# EAGLE schematic as3320-BandPass (EAGLE 9.6.2)

## Sheet 1 of 5: CEM
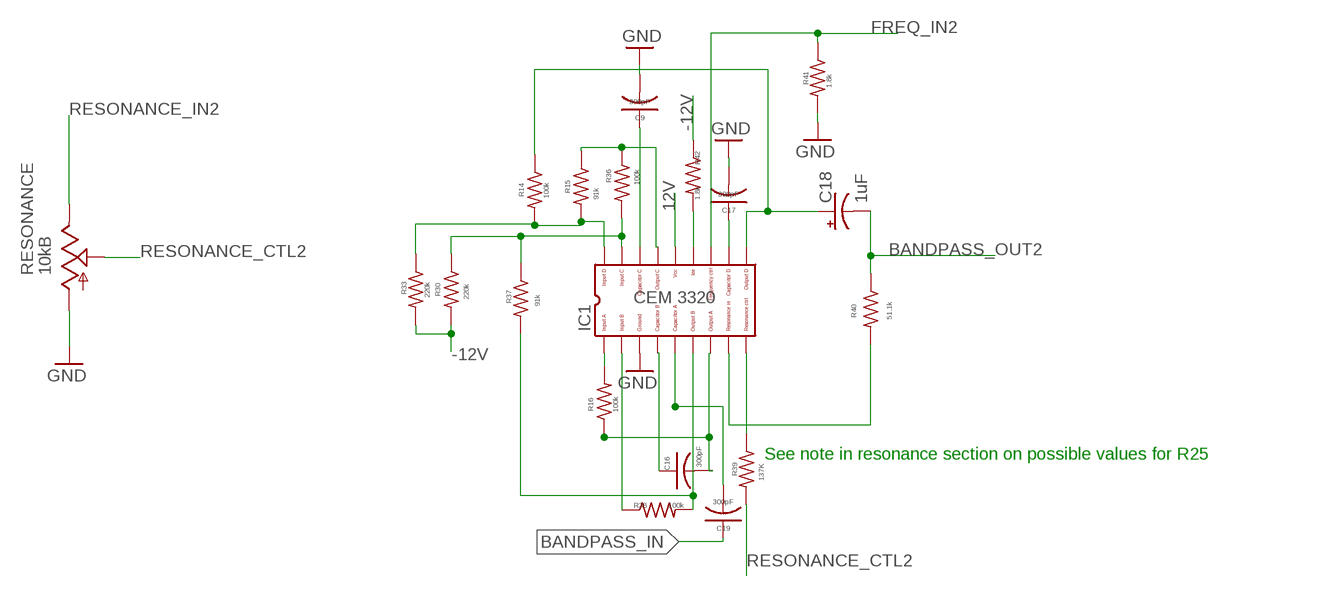
[diagram p0: schematic, sheet 1]

### Parts
C9  300pF  C-USC0805K  [C0805K]
C16  300pF  C-USC0805K  [C0805K]
C17  300pF  C-USC0805K  [C0805K]
C18  1uF  CPOL-USB  [PANASONIC_B]
C19  300pF  C-USC0805K  [C0805K]
IC1  CEM3320  [DIL18]
R14  100k  GMSN_R-US_M0805  [GMSN_M0805]
R15  91k  GMSN_R-US_M0805  [GMSN_M0805]
R16  100k  GMSN_R-US_M0805  [GMSN_M0805]
R30  220k  GMSN_R-US_M0805  [GMSN_M0805]
R33  220k  GMSN_R-US_M0805  [GMSN_M0805]
R36  100k  GMSN_R-US_M0805  [GMSN_M0805]
R37  91k  GMSN_R-US_M0805  [GMSN_M0805]
R38  100k  GMSN_R-US_M0805  [GMSN_M0805]
R39  137K  GMSN_R-US_M0805  [GMSN_M0805]
R40  51.1k  GMSN_R-US_M0805  [GMSN_M0805]
R41  1.8k  GMSN_R-US_M0805  [GMSN_M0805]
R42  1.8k  GMSN_R-US_M0805  [GMSN_M0805]
RESONANCE  10kB  POT_USVERTICAL  [ALPS_POT_VERTICAL]

### Nets
12V [power]: IC1.14 ; also sheet 2,3
-12V [power]: R30.2 R33.2 R42.1 ; also sheet 2,3
BANDPASS_IN: C19.1 ; also sheet 3
BANDPASS_OUT2: C18.- R40.1 ; also sheet 5
FREQ_IN2: IC1.12 R41.1 ; also sheet 3
GND [power]: C9.2 C17.2 IC1.3 R41.2 RESONANCE.P$3(A) ; also sheet 2,3,4,5
N$18 [nearfilter]: C17.1 IC1.11
N$21: IC1.9 R39.1
N$28 [nearfilter]: IC1.8 R40.2
N$29 [nearfilter]: IC1.13 R42.2
N$30: C9.1 IC1.16
N$31 [nearfilter]: C18.+ IC1.10 R14.1
N$32: C19.2 IC1.5
N$33: C16.2 IC1.7 R16.1
N$34: C16.1 IC1.4
N$35: IC1.2 R38.1
N$36: IC1.6 R37.2 R38.2
N$37: IC1.1 R16.2
N$38: IC1.17 R30.1 R36.2 R37.1
N$41: IC1.15 R15.1 R36.1
N$42: IC1.18 R14.2 R15.2 R33.1
RESONANCE_CTL2: R39.2 RESONANCE.P$2(S)
RESONANCE_IN2: RESONANCE.P$1(E) ; also sheet 3

### Notes on the sheet
- See note in resonance section on possible values for R25

## Sheet 2 of 5: Power
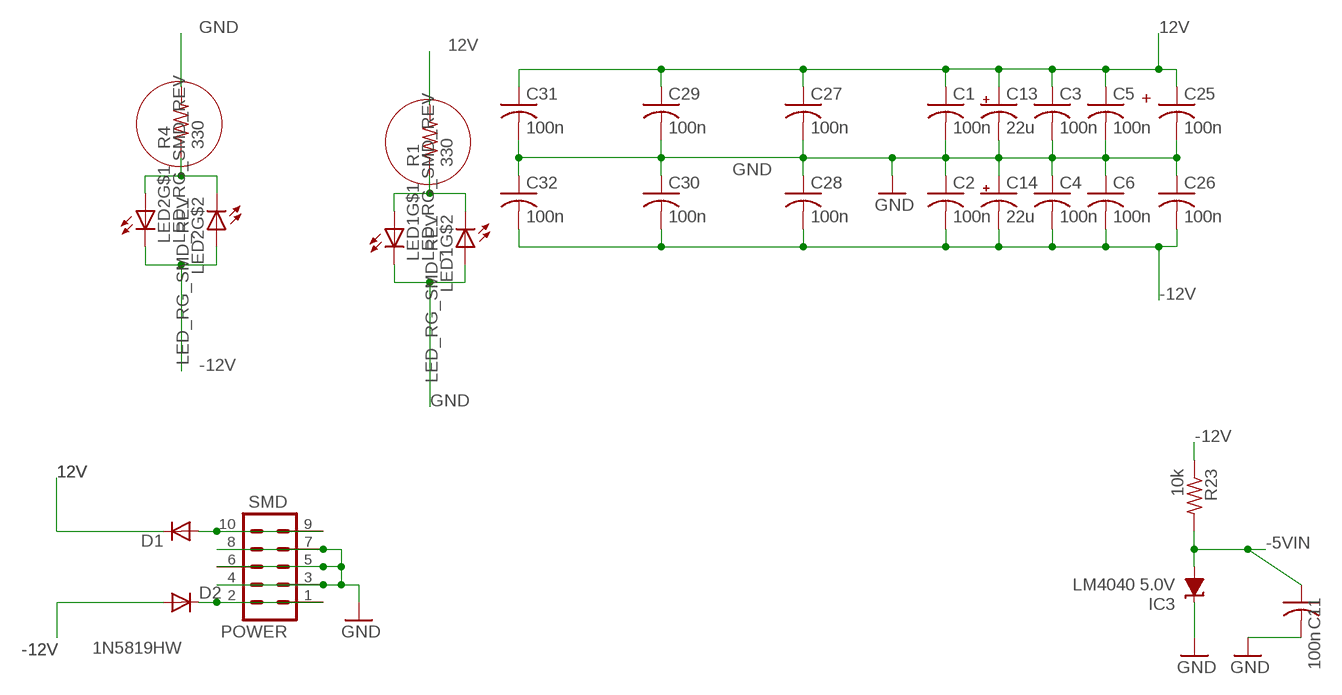
[diagram p1: schematic, sheet 2]

### Parts
C1  100n  C-USC0805K  [C0805K]
C2  100n  C-USC0805K  [C0805K]
C3  100n  C-USC0805K  [C0805K]
C4  100n  C-USC0805K  [C0805K]
C5  100n  C-USC0805K  [C0805K]
C6  100n  C-USC0805K  [C0805K]
C11  100n  GMSN_C-USC0805K  [GMSN_C0805K]
C13  22u  CPOL-USB  [PANASONIC_B]
C14  22u  CPOL-USB  [PANASONIC_B]
C25  100n  C-USC0805K  [C0805K]
C26  100n  C-USC0805K  [C0805K]
C27  100n  C-USC0805K  [C0805K]
C28  100n  C-USC0805K  [C0805K]
C29  100n  C-USC0805K  [C0805K]
C30  100n  C-USC0805K  [C0805K]
C31  100n  C-USC0805K  [C0805K]
C32  100n  C-USC0805K  [C0805K]
D1  1N5819HW  DIODE-SOD123  [SOD123]
D2  1N5819HW  DIODE-SOD123  [SOD123]
IC3  LM4040 5.0V  LM4041C12DBZ  [DBZ_R-PDSO-G3]
LED1  LED_RG_SMD_REV  [LSG_T77K]
LED2  LED_RG_SMD_REV  [LSG_T77K]
POWER  SMD  CONN_05X2SHD_SMD  [2X5-SHROUDED_SMD]
R1  330  GMSN_R-US_M0805  [GMSN_M0805]
R4  330  GMSN_R-US_M0805  [GMSN_M0805]
R23  10k  GMSN_R-US_M0805  [GMSN_M0805]

### Nets
12V [power]: C1.1 C3.1 C5.1 C13.+ C25.1 C27.1 C29.1 C31.1 D1.C R1.2 ; also sheet 1,3
-5VIN [power]: C11.1 IC3.2(A) R23.2 ; also sheet 4
-12V [power]: C2.2 C4.2 C6.2 C14.- C26.2 C28.2 C30.2 C32.2 D2.A LED2.1(C) LED2.4(A) R23.1 ; also sheet 1,3
-12V-P: D2.C POWER.1 POWER.2
GND [power]: C1.2 C2.1 C3.2 C4.1 C5.2 C6.1 C11.2 C13.- C14.+ C25.2 C26.1 C27.2 C28.1 C29.2 C30.1 C31.2 C32.1 IC3.1(C) LED1.1(C) LED1.4(A) POWER.3 POWER.4 POWER.5 POWER.6 POWER.7 POWER.8 R4.2 ; also sheet 1,3,4,5
N$6: D1.A POWER.9 POWER.10
N$74: LED2.2(A) LED2.3(C) R4.1
N$75: LED1.2(A) LED1.3(C) R1.1

### Notes on the sheet
- +

## Sheet 3 of 5: Input
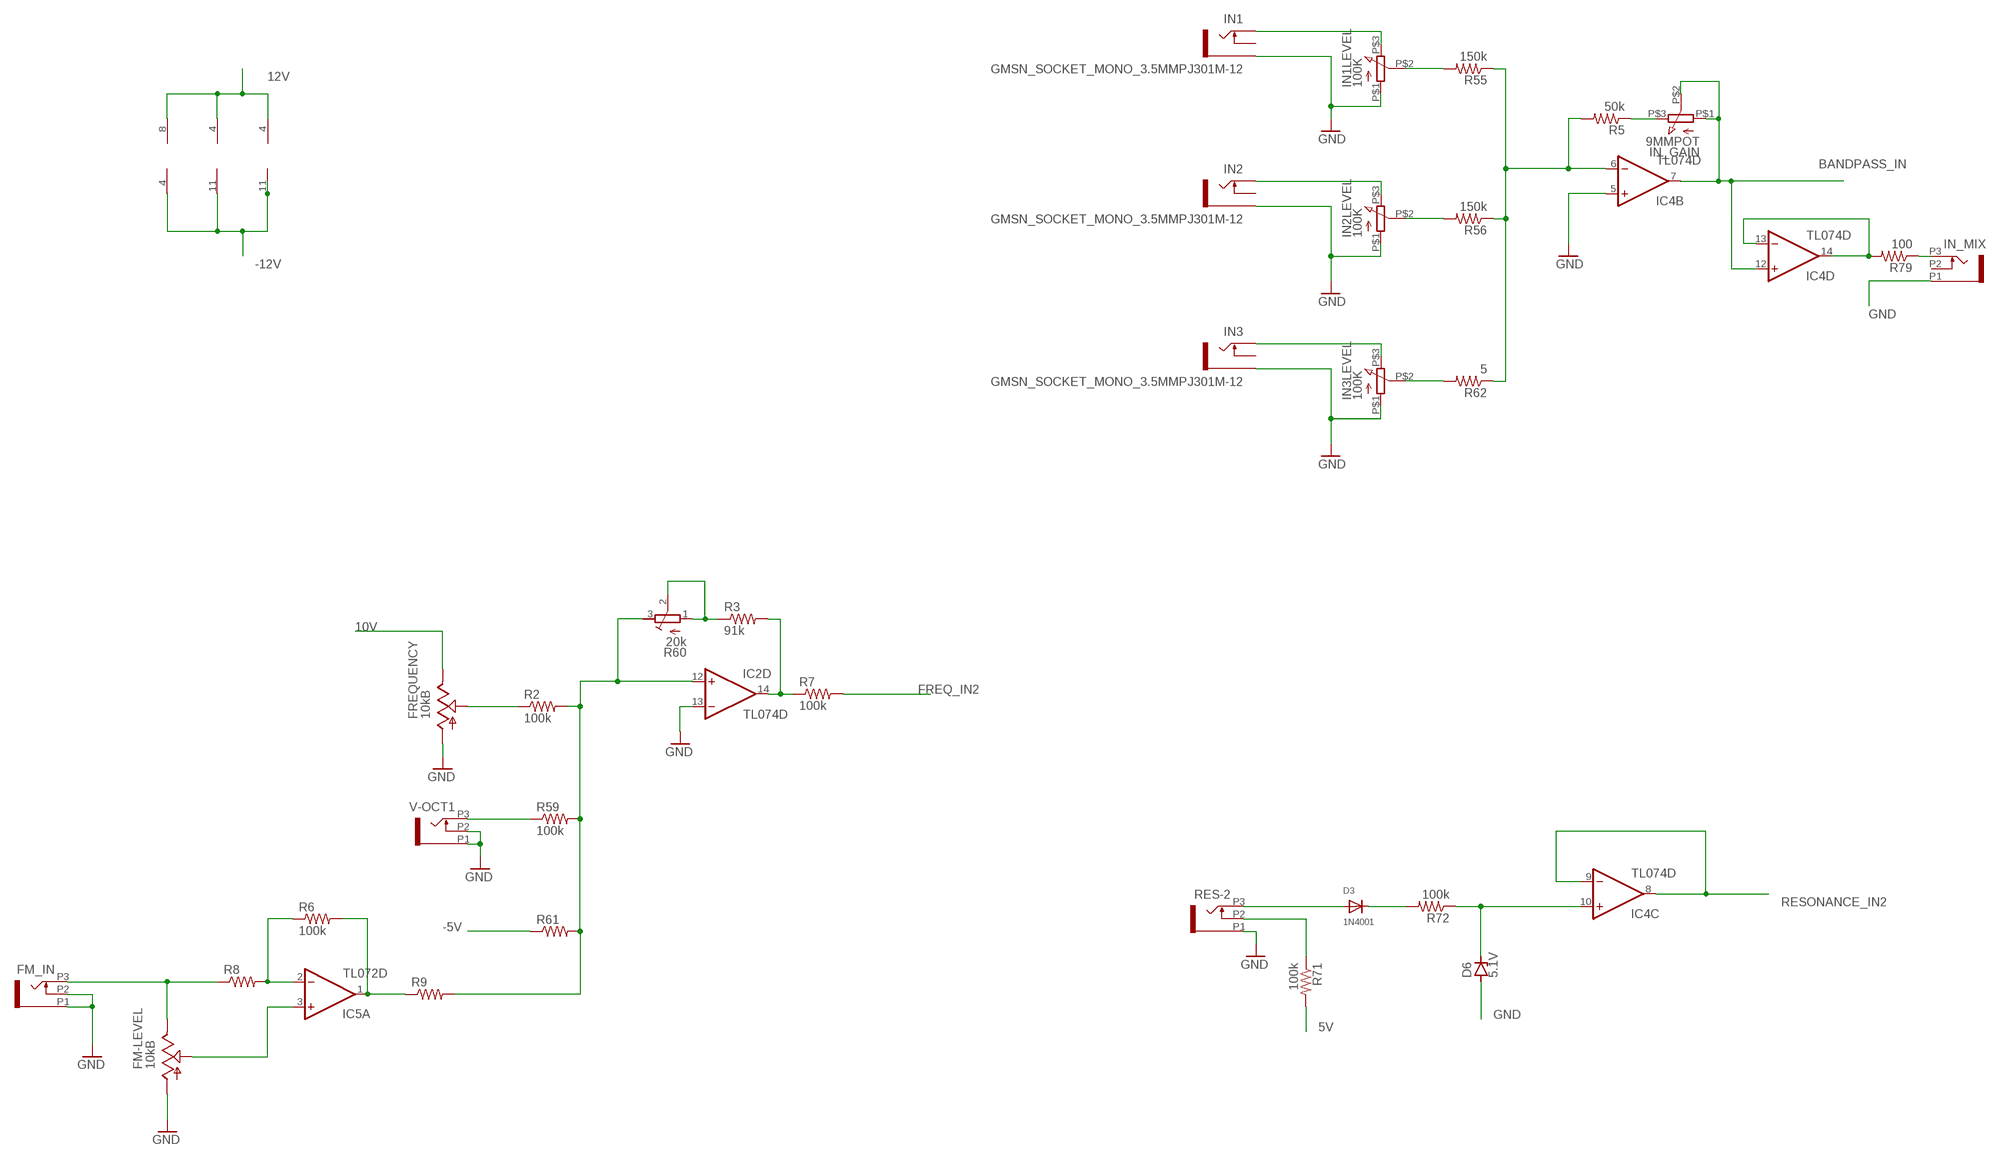
[diagram p2: schematic, sheet 3]

### Parts
D3  1N4001  DIODESMA  [SMADIODE]
D6  5.1V  ZENER-DIODESOT23  [SOT23]
FM-LEVEL  10kB  POT_USVERTICAL  [ALPS_POT_VERTICAL]
FM_IN  PJ301_THONKICONN6  [WQP_PJ_301M6]
FREQUENCY  10kB  POT_USVERTICAL  [ALPS_POT_VERTICAL]
IC2  TL074D  [SO14]
IC4  TL074D  [SO14]
IC5  TL072D  [SO08]
IN1  GMSN_SOCKET_MONO_3.5MMPJ301M-12  [GMSN_PJ301M-12]
IN1LEVEL  100K  9MMPOT  [POT]
IN2  GMSN_SOCKET_MONO_3.5MMPJ301M-12  [GMSN_PJ301M-12]
IN2LEVEL  100K  9MMPOT  [POT]
IN3  GMSN_SOCKET_MONO_3.5MMPJ301M-12  [GMSN_PJ301M-12]
IN3LEVEL  100K  9MMPOT  [POT]
IN_GAIN  9MMPOT  [POT]
IN_MIX  PJ301_THONKICONN6  [WQP_PJ_301M6]
R2  100k  GMSN_R-US_M0805  [GMSN_M0805]
R3  91k  GMSN_R-US_M0805  [GMSN_M0805]
R5  50k  GMSN_R-US_M0805  [GMSN_M0805]
R6  100k  GMSN_R-US_M0805  [GMSN_M0805]
R7  100k  GMSN_R-US_M0805  [GMSN_M0805]
R8  62k  GMSN_R-US_M0805  [GMSN_M0805]
R9  62k  GMSN_R-US_M0805  [GMSN_M0805]
R55  150k  R-US_R0805  [R0805]
R56  150k  R-US_R0805  [R0805]
R59  100k  GMSN_R-US_M0805  [GMSN_M0805]
R60  20k  R-TRIMM3296X  [RTRIM3296X]
R61  62k  GMSN_R-US_M0805  [GMSN_M0805]
R62  5  R-US_R0805  [R0805]
R71  100k  R-US_R0805  [R0805]
R72  100k  GMSN_R-US_M0805  [GMSN_M0805]
R79  100  GMSN_R-US_M0805  [GMSN_M0805]
RES-2  PJ301_THONKICONN6  [WQP_PJ_301M6]
V-OCT1  PJ301_THONKICONN6  [WQP_PJ_301M6]

### Nets
5V [power]: R71.2 ; also sheet 4
10V [power]: FREQUENCY.P$1(E) ; also sheet 4
12V [power]: IC2.4(P:V+) IC4.4(P:V+) IC5.8(P:V+) ; also sheet 1,2
-5V [power]: R61.1 ; also sheet 4
-12V [power]: IC2.11(P:V-) IC4.11(P:V-) IC5.4(P:V-) ; also sheet 1,2
BANDPASS_IN: IC4.7(B:OUT) IC4.12(D:+IN) IN_GAIN.P$1 IN_GAIN.P$2 ; also sheet 1
FREQ_IN2: R7.2 ; also sheet 1
GND [power]: D6.1(A) FM-LEVEL.P$3(A) FM_IN.P1 FM_IN.P2 FREQUENCY.P$3(A) IC2.13(D:-IN) IC4.5(B:+IN) IN1.GND(SLEEVE) IN1LEVEL.P$1 IN2.GND(SLEEVE) IN2LEVEL.P$1 IN3.GND(SLEEVE) IN3LEVEL.P$1 IN_MIX.P1 RES-2.P1 V-OCT1.P1 V-OCT1.P2 ; also sheet 1,2,4,5
N$1: IC5.1(A:OUT) R6.2 R9.1
N$2: IC5.2(A:-IN) R6.1 R8.2
N$3: IC2.14(D:OUT) R3.2 R7.1
N$5: FREQUENCY.P$2(S) R2.1
N$7: FM-LEVEL.P$2(S) IC5.3(A:+IN)
N$8: FM-LEVEL.P$1(E) FM_IN.P3 R8.1
N$9: R71.1 RES-2.P2
N$12: IC2.12(D:+IN) R2.2 R9.2 R59.2 R60.3(A) R61.2
N$20: IN_GAIN.P$3 R5.1
N$67: R59.1 V-OCT1.P3
N$68: R3.1 R60.1(E) R60.2(S)
N$76: IN1.TIP IN1LEVEL.P$3
N$77: IN2.TIP IN2LEVEL.P$3
N$78: D3.A RES-2.P3
N$79: IN1LEVEL.P$2 R55.2
N$80: IN2LEVEL.P$2 R56.2
N$82: IN3.TIP IN3LEVEL.P$3
N$83: IN3LEVEL.P$2 R62.2
N$84: IC4.6(B:-IN) R5.2 R55.1 R56.1 R62.1
N$85: D3.C R72.2
N$89: D6.3(C) IC4.10(C:+IN) R72.1
N$102: IC4.13(D:-IN) IC4.14(D:OUT) R79.2
N$103: IN_MIX.P3 R79.1
RESONANCE_IN2: IC4.8(C:OUT) IC4.9(C:-IN) ; also sheet 1
Unconnected: IC5.5(B:+IN) IC5.6(B:-IN) IC5.7(B:OUT) IN1.NORM(SWITCH) IN2.NORM(SWITCH) IN3.NORM(SWITCH) IN_MIX.P2

## Sheet 4 of 5: Ref
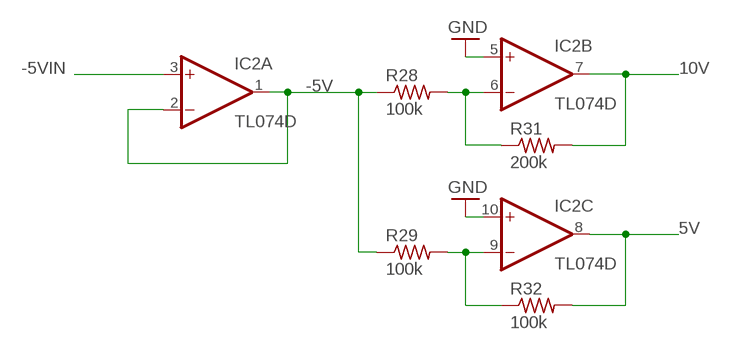
[diagram p3: schematic, sheet 4]

### Parts
R28  100k  GMSN_R-US_M0805  [GMSN_M0805]
R29  100k  GMSN_R-US_M0805  [GMSN_M0805]
R31  200k  GMSN_R-US_M0805  [GMSN_M0805]
R32  100k  GMSN_R-US_M0805  [GMSN_M0805]

### Nets
5V [power]: IC2.8(C:OUT) R32.2 ; also sheet 3
10V [power]: IC2.7(B:OUT) R31.2 ; also sheet 3
-5V [power]: IC2.1(A:OUT) IC2.2(A:-IN) R28.1 R29.1 ; also sheet 3
-5VIN [power]: IC2.3(A:+IN) ; also sheet 2
GND [power]: IC2.5(B:+IN) IC2.10(C:+IN) ; also sheet 1,2,3,5
N$13: IC2.9(C:-IN) R29.2 R32.1
N$15: IC2.6(B:-IN) R28.2 R31.1

## Sheet 5 of 5: Output
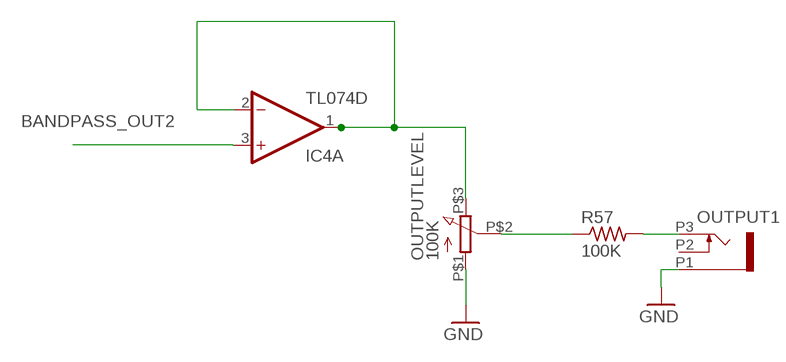
[diagram p4: schematic, sheet 5]

### Parts
OUTPUT1  PJ301_THONKICONN6  [WQP_PJ_301M6]
OUTPUTLEVEL  100K  9MMPOT  [POT]
R57  100K  GMSN_R-US_M0805  [GMSN_M0805]

### Nets
BANDPASS_OUT2: IC4.3(A:+IN) ; also sheet 1
GND [power]: OUTPUT1.P1 OUTPUTLEVEL.P$1 ; also sheet 1,2,3,4
N$4: OUTPUTLEVEL.P$2 R57.1
N$63: IC4.1(A:OUT) IC4.2(A:-IN) OUTPUTLEVEL.P$3
O2: OUTPUT1.P3 R57.2
Unconnected: OUTPUT1.P2

## Library data of the parts
C1-C6 C9 C16 C17 C19 C25-C32 = rcl:C-US: CAPACITOR, American symbol; SPICEPREFIX: C
C11 = Pure VCF:GMSN_C-US: CAPACITOR, American symbol
C13 C14 = rcl:CPOL-US: POLARIZED CAPACITOR, American symbol
C18 = rcl:CPOL-US: POLARIZED CAPACITOR, American symbol; SPICEPREFIX: C
D1 D2 = diode:DIODE-: DIODE
D3 = GMSN:DIODE: Diode SMADIODE - SMA Surface Mount Package 20V 1A Schottky Diode Digikey: 641-1014-6-ND DO-1N4148 - Through Hole Small Current Diode SOD-123 20V 1 A (.5mV Vf) Schottky Diode - Digikey: MBRX120TPMSCT-ND SOD-323 10V 570mA (.38mV Vf, 3ns) Schottky Diode - Digikey: ZLLS410CT-ND SOD-523 30V 30mA Schottky Diode (RB751S-40TE61) - Digikey: RB751S-40TE61CT-ND SOT23-R/W - SOT23 Package (R = Solder Paste/Reflow Ovens, W = Hand-Soldering) BAT54Film 40V 300mA - Digikey: 497-7162-1-ND
D6 = diode:ZENER-DIODE: Z-Diode; RS-PART: 816-7962
FM-LEVEL FREQUENCY RESONANCE = og-pots:POT_US
FM_IN IN_MIX OUTPUT1 RES-2 V-OCT1 = og-pj301_variations:PJ301_THONKICONN
IC1 = CEM:CEM3320: CEM 3330 VCF
IC2 = linear:TL074: OP AMP
IC3 = texas:LM4041: PRECISION MICROPOWER SHUNT VOLTAGE REFERENCE Source: http://focus.ti.com/lit/ds/slcs146e/slcs146e.pdf
IC4 = GMSN:TL074: OP AMP
IC5 = GMSN-R2Project:TL072: OP AMP
IN1-IN3 = Pure VCO:GMSN_SOCKET_MONO_3.5MM: 3.5 mm Jack Socket; SORT: 8
IN1LEVEL IN2LEVEL IN3LEVEL IN_GAIN OUTPUTLEVEL = GMSN:9MMPOT
LED1 = INSTRUO:LED_RG_SMD_REV: http://uk.rs-online.com/web/p/visible-leds/7193196/; RS-PART: 915-4828
LED2 = INSTRUO:LED_RG_SMD_REV: http://uk.rs-online.com/web/p/visible-leds/7193196/
POWER = SparkFun-Connectors:CONN_05X2: Multi connection point. Often used as Generic Header-pin footprint for 0.1 inch spaced/style header connections For AVR SPI programming port, see special device with nice symbol: "AVR_SPI_PROG_5x2.dev" You can populate with any combo of single row headers, but if you'd like an exact match, check these: 2x5 AVR ICSP Male Header <https://www.sparkfun.com/products/778> (PRT-00778) 2x5 Pin Shrouded Header <https://www.sparkfun.com/products/8506> (PRT-08506) On any of the 0.1 inch spaced packages, you can populate with these: Break Away Headers - Straight <https://www.sparkfun.com/products/116> (PRT-00116) Break Away Male Headers - Right Angle <https://www.sparkfun.com/products/553> (PRT-00553) Female Headers <https://www.sparkfun.com/products/115> (PRT-00115) Break Away Headers - Machine Pin <https://www.sparkfun.com/products/117> (PRT-00117) Break Away Female Headers - Swiss Machine Pin <https://www.sparkfun.com/products/743> (PRT-00743) Special note: the shrouded connector mates well with our 5x2 ribbon cables: 2x5 Pin IDC Ribbon Cable <https://www.sparkfun.com/products/8535> (PRT-08535); PROD_ID: CONN-09508; RS-PART: 828-1783
R1-R3 R5-R9 R14-R16 R23 R28-R33 R36-R42 R57 R59 R61 R72 R79 = Pure VCF:GMSN_R-US_: RESISTOR, American symbol
R4 = Pure VCF:GMSN_R-US_: RESISTOR, American symbol; RS-PART: 915-4828
R55 R56 R62 R71 = GMSN:R-US_: RESISTOR, American symbol
R60 = rcl:R-TRIMM: Trimm resistor

## Net classes
0 default: width 0.152 mm
1 power: width 0.406 mm
2 nearfilter: width 0.152 mm